# EAGLE design KwadraLampaBT (EAGLE 6.1)
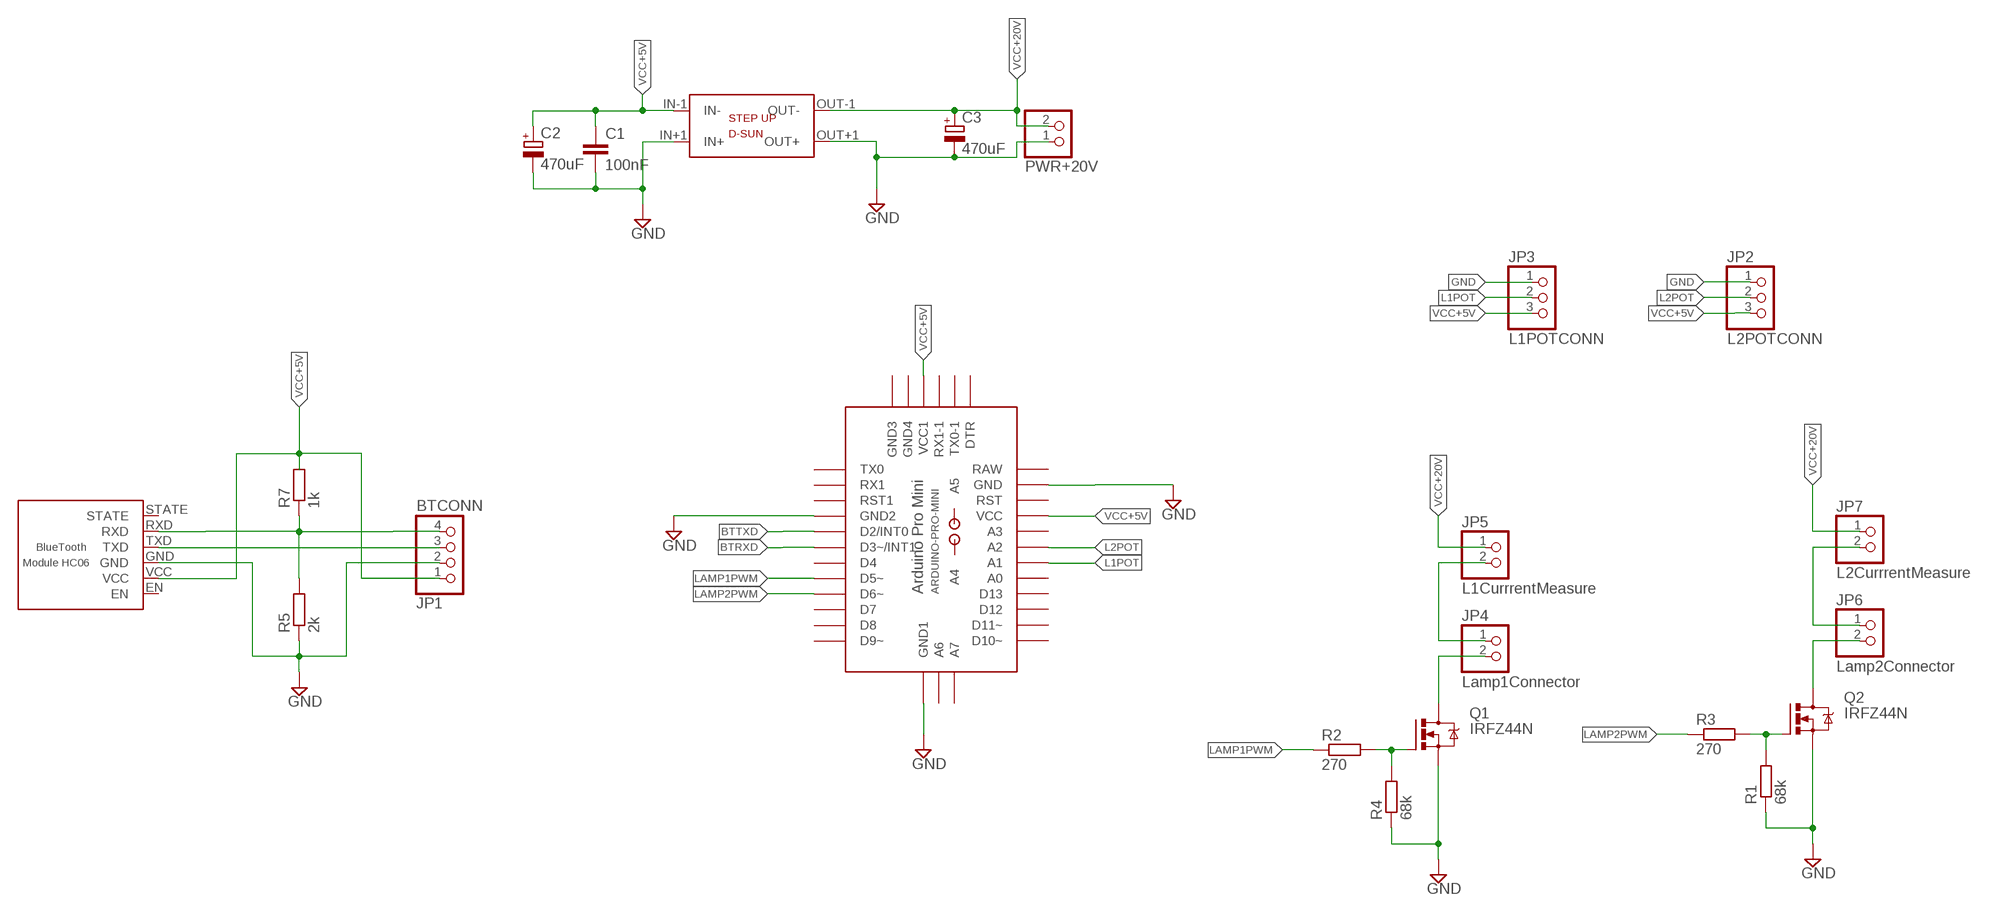
[diagram p0: schematic, sheet 1]

## Parts
C1  100nF  C_CERAMIC_2.5X50  [C025-025X050]
C2  470uF  C_ELECTROLYTIC_3  [C_E_R5-FI13_ELECTROLYTIC]
C3  470uF  C_ELECTROLYTIC_3  [C_E_R5-FI13_ELECTROLYTIC]
IC1  HC06  [HC06]
JP1  BTCONN  PINHD-1X4  [1X04]
JP2  L2POTCONN  PINHD-1X3  [1X03]
JP3  L1POTCONN  PINHD-1X3  [1X03]
JP4  Lamp1Connector  PINHD-1X2  [1X02]
JP5  L1CurrrentMeasure  PINHD-1X2  [1X02]
JP6  Lamp2Connector  PINHD-1X2  [1X02]
JP7  L2CurrrentMeasure  PINHD-1X2  [1X02]
PWR+20V  PINHD-1X2  [1X02]
Q1  IRFZ44N  IRFZ44NVERT  [TO220AB-GDS-VERT]
Q2  IRFZ44N  IRFZ44NVERT  [TO220AB-GDS-VERT]
R1  68k  R_SMD1206  [SMD1206]
R2  270  R_SMD1206  [SMD1206]
R3  270  R_SMD1206  [SMD1206]
R4  68k  R_SMD1206  [SMD1206]
R5  2k  R_SMD1206  [SMD1206]
R7  1k  R_SMD1206  [SMD1206]
U$1  ARDUINO-PRO-MINI  [ARDUINO-PRO-MINI]
U$2  STEPUP_D-SUN  [STEPUP_D-SUN]

## Nets
BTRXD: IC1.RXD JP1.4 R5.2 R7.1 U$1.D3(D3~/INT1)
BTTXD: IC1.TXD JP1.3 U$1.D2(D2/INT0)
GND: C1.2 C2.- C3.- IC1.GND JP1.2 JP2.1 JP3.1 PWR+20V.1 Q1.S Q2.S R1.1 R4.1 R5.1 U$1.GND U$1.GND1(GND2) U$1.GND4(GND1) U$2.IN+1(IN+) U$2.OUT+1(OUT+)
L1POT: JP3.2 U$1.A1
L2POT: JP2.2 U$1.A2
LAMP1PWM: R2.1 U$1.D5(D5~)
LAMP2PWM: R3.1 U$1.D6(D6~)
N$1: JP4.2 Q1.D
N$2: JP6.2 Q2.D
N$3: Q2.G R1.2 R3.2
N$4: Q1.G R2.2 R4.2
N$6: JP4.1 JP5.2
N$7: JP6.1 JP7.2
VCC+5V: C1.1 C2.+ IC1.VCC JP1.1 JP2.3 JP3.3 R7.2 U$1.VCC U$1.VCC1 U$2.IN-1(IN-)
VCC+20V: C3.+ JP5.1 JP7.1 PWR+20V.2 U$2.OUT-1(OUT-)
Unconnected: IC1.EN IC1.STATE U$1.A0 U$1.A3 U$1.A4 U$1.A5 U$1.A6 U$1.A7 U$1.D4 U$1.D7 U$1.D8 U$1.D9(D9~) U$1.D10(D10~) U$1.D11(D11~) U$1.D12 U$1.D13 U$1.DTR U$1.GND2(GND3) U$1.GND3(GND4) U$1.RAW U$1.RST U$1.RST1 U$1.RX1 U$1.RX1-1 U$1.TX0 U$1.TX0-1

## Library data of the parts
C1 = 00 My RLC:C_CERAMIC_
C2 C3 = 00 My RLC:C_ELECTROLYTIC_
IC1 = 00 MyModules:HC06
JP1 = 00 My Pinheaders:PINHD-1X4: PIN HEADER
JP2 JP3 = 00 My Pinheaders:PINHD-1X3: PIN HEADER
JP4-JP7 PWR+20V = 00 My Pinheaders:PINHD-1X2: PIN HEADER
Q1 Q2 = 00 My Transistors:IRFZ44N: IRFZ44N HEXFET® Power MOSFET VDSS = 55V RDS(on) = 17.5mW ID = 49A VGS(th) Gate Threshold Voltage 2.0 ––– 4.0 V VDS = VGS, ID = 250μA
R1-R5 R7 = 00 My RLC:R_
U$1 = 00 Arduino-clone:ARDUINO-PRO-MINI: Arduino Pro-Mini Arduino Clone by KubaMiszcz 2016
U$2 = 00 MyModules:STEPUP_D-SUN

## Board
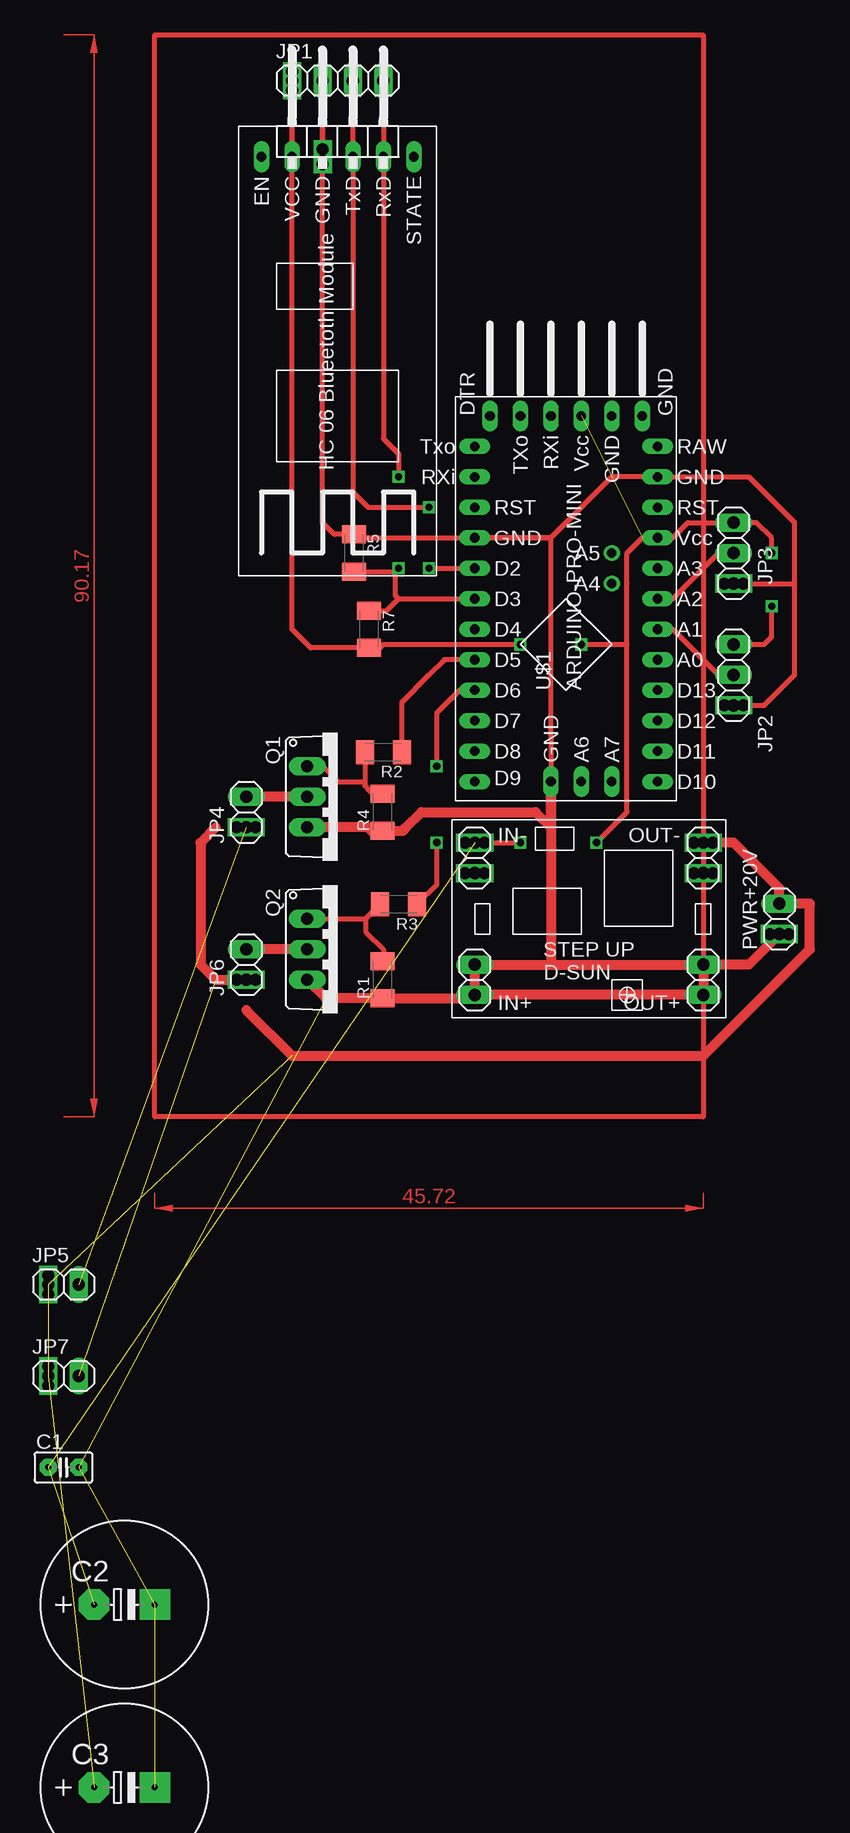
[diagram p1: board, top side]
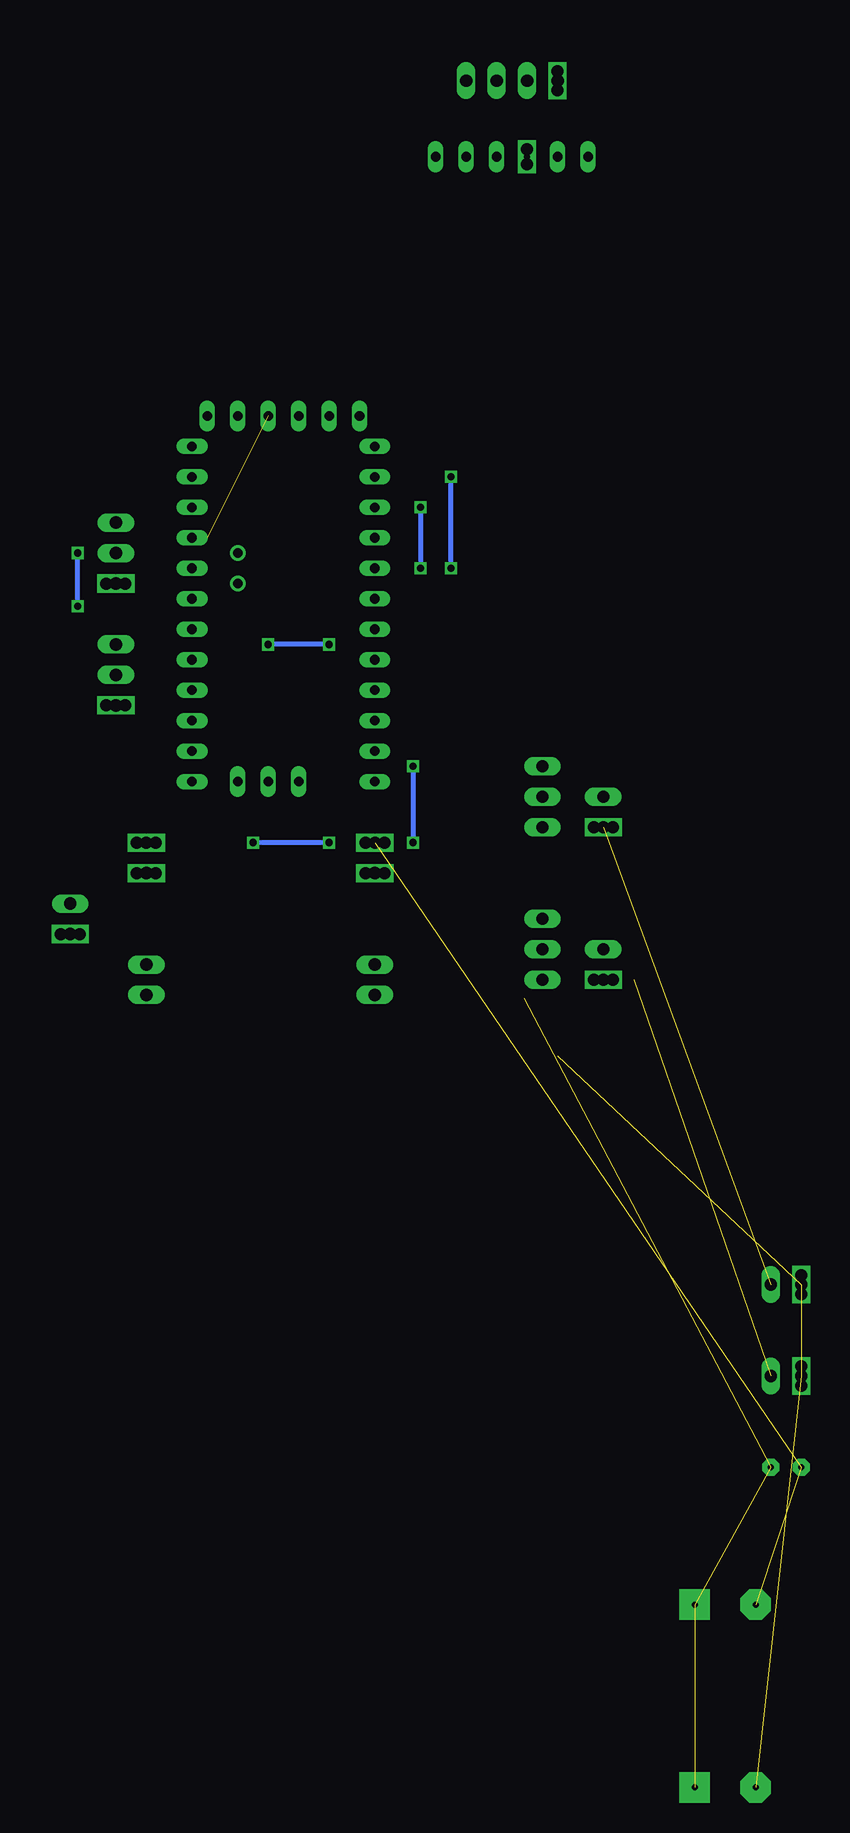
[diagram p2: board, bottom side, seen from below]

No outline drawn. Coordinates in mm, seen from the top.
Copper layers (1*16): Top 0.035mm / dielectric 1.5mm / Bottom 0.035mm
Design rules: minimum track width 10mil, minimum drill 24mil, track to track 8mil, track to pad 8mil, pad to pad 8mil, via to via 8mil, smd to smd 8mil, copper to edge 40mil, drill to drill 8mil, minimum pad ring 10mil, minimum via ring 8mil, stop-mask expansion 4mil, vias tented up to drill 0mil, thermal gap 10mil

### Footprints (pad centres in the part's own frame; a part is rotated, then mirrored left to right if it is on the bottom)
C025-025X050 = drill 0.5 pad 1.422 octagon: 1 -1.27,0; 2 1.27,0
C_E_R5-FI13_ELECTROLYTIC = drill 0.5 pad 2.54 octagon: + -2.54,0 | drill 0.5 pad 2.54 square: - 2.54,0
HC06 = drill 0.8 long: EN -12.7,-5.08; RXD -12.7,5.08; STATE -12.7,7.62; TXD -12.7,2.54; VCC -12.7,-2.54 | drill 0.5 pad 1.27 long: GND -12.7,0 | drill 1 square: P$4 -13.335,0.032; P$5 -13.335,0.032; P$6 -12.065,0.032
1X04 = drill 1.016 long: 1 -3.81,0; 2 -1.27,0; 3 1.27,0; 4 3.81,0 | drill 1 square: P$1 -3.81,0.794; P$2 -3.81,-0.794 | drill 1 long: P$3 -3.81,0
1X03 = drill 1.016 long: 1 -2.54,0; 2 0,0; 3 2.54,0 | drill 1 square: P$1 -2.54,0.794; P$2 -2.54,-0.794 | drill 1 long: P$3 -2.54,0
1X02 = drill 1.016 long: 1 -1.27,0; 2 1.27,0 | drill 1 square: P$1 -1.27,0.794; P$2 -1.27,-0.794 | drill 1 long: P$3 -1.27,0
TO220AB-GDS-VERT = drill 1.016 long: D 0,0; G -2.54,0; S 2.54,0
SMD1206 = smd 1.5 x 2: 1 -1.554,0.077; 2 1.546,0.077
ARDUINO-PRO-MINI = drill 0.8 long: A0 7.62,6.35; A1 7.62,3.81; A2 7.62,1.27; A3 7.62,-1.27; A6 1.27,-11.43; A7 3.81,-11.43; D2 -7.62,6.35; D3 -7.62,3.81; D4 -7.62,1.27; D5 -7.62,-1.27; D6 -7.62,-3.81; D7 -7.62,-6.35; D8 -7.62,-8.89; D9 -7.62,-11.43; D10 7.62,-11.43; D11 7.62,-8.89; D12 7.62,-6.35; D13 7.62,-3.81; DTR -6.35,19.05; GND 7.62,13.97; GND1 -7.62,8.89; GND2 6.35,19.05; GND3 3.81,19.05; GND4 -1.27,-11.43; RAW 7.62,16.51; RST 7.62,11.43; RST1 -7.62,11.43; RX1 -7.62,13.97; RX1-1 -1.27,19.05; TX0 -7.62,16.51; TX0-1 -3.81,19.05; VCC 7.62,8.89; VCC1 1.27,19.05 | drill 0.8: A4 3.81,5.08; A5 3.81,7.62
STEPUP_D-SUN = drill 1.016 long: 1 -10.16,3.81; 4 8.89,3.81; IN+1 -10.16,-3.81; IN+2 -10.16,-6.35; OUT+1 8.89,-3.81; OUT+2 8.89,-6.35 | drill 1 long: IN-1 -10.16,6.35; IN-2 -10.16,3.81; OUT-1 8.89,6.35; OUT-2 8.89,3.81 | drill 1 square: P$1 -10.954,3.81; P$2 -9.366,3.81; P$4 8.096,3.81; P$5 9.684,3.81; P$7 -10.954,6.35; P$8 -9.366,6.35; P$10 8.096,6.35; P$11 9.684,6.35

### Placement (x,y rotation side)
C1  3.81,-148.59 0 top
C2  8.89,-160.02 0 top
C3  8.89,-175.26 0 top
IC1  25.4,-52.07 270 top
JP1  26.67,-33.02 0 top
JP2  59.69,-82.55 90 top
JP3  59.69,-72.39 90 top
JP4  19.05,-93.98 90 top
JP5  3.81,-133.35 0 top
JP6  19.05,-106.68 90 top
JP7  3.81,-140.97 0 top
PWR+20V  63.5,-102.87 90 top
Q1  24.13,-92.71 270 top
Q2  24.13,-105.41 270 top
R1  30.48,-107.95 90 top
R2  30.48,-88.9 180 top
R3  31.75,-101.6 180 top
R4  30.48,-93.98 90 top
R5  27.94,-72.39 270 top
R7  29.21,-78.74 270 top
U$1  45.72,-80.01 0 top
U$2  48.26,-102.87 0 top

### Tracks (layer width: path | path; a pad name or v marks a point on that pad's centre or on a via)
BTRXD  (via drill 0.6)
  Top 0.406: JP1.4 IC1.RXD 30.48,-62.87 31.75,-64.14 v31.75,-66.04 | R7.1 29.49,-77.19 30.76,-77.19 31.75,-76.2 | 31.75,-76.2 U$1.D3 | R5.2 31.47,-73.94 | 31.47,-73.94 v31.75,-73.66 | 31.47,-73.94 31.47,-75.92 31.75,-76.2
  Bottom 0.406: v31.75,-73.66 v31.75,-66.04
BTTXD  (via drill 0.6)
  Top 0.406: JP1.3 IC1.TXD 27.94,-67.31 29.21,-68.58 v34.29,-68.58 | v34.29,-73.66 34.92,-73.66 U$1.D2
  Bottom 0.406: v34.29,-68.58 v34.29,-73.66
GND  (3 unrouted)
  Top 0.406: 44.45,-71.12 49.53,-66.04 U$1.GND 60.96,-66.04 64.77,-69.85 64.77,-74.93 | 44.45,-71.12 U$1.GND1 | U$1.GND1 44.45,-71.12 | IC1.GND JP1.2 IC1.GND | U$1.GND1 44.45,-71.12 | U$1.GND4 44.45,-87.63 44.45,-74.93 44.45,-71.12 | 64.77,-74.93 64.77,-82.55 62.23,-85.09 JP2.1 | JP3.1 64.77,-74.93 | IC1.GND 25.4,-69.85 26.39,-70.84 27.66,-70.84 R5.1 28.29,-70.84 28.57,-71.12 U$1.GND1
  Top 0.813: PWR+20V.1 60.96,-106.68 U$2.OUT+1 | U$2.OUT+1 57.15,-109.22 38.1,-109.22 | 38.1,-109.22 U$2.IN+1 44.45,-106.68 | 44.45,-106.68 U$2.OUT+1 | 44.45,-95.25 U$1.GND4 44.45,-95.25 | 44.45,-95.25 44.45,-106.68 | 38.1,-109.22 37.82,-109.5 R1.1 25.68,-109.5 Q2.S | 44.45,-95.25 43.18,-93.98 33.66,-93.98 32.38,-95.25 32.1,-95.53 R4.1 29.49,-95.53 29.21,-95.25 Q1.S
L1POT
  Top 0.406: U$1.A1 54.61,-76.2 58.42,-72.39 JP3.2
L2POT
  Top 0.406: U$1.A2 54.61,-78.74 58.42,-82.55 JP2.2
LAMP1PWM
  Top 0.406: U$1.D5 35.56,-81.28 34.29,-82.55 32.03,-84.81 R2.1
LAMP2PWM  (via drill 0.6)
  Top 0.406: U$1.D6 36.83,-83.82 35.56,-85.09 34.92,-85.72 v34.92,-90.17 | R3.1 34.92,-100.06 v34.92,-96.52
  Bottom 0.406: v34.92,-90.17 v34.92,-96.52
N$1
  Top 0.813: Q1.D JP4.2
N$2
  Top 0.813: Q2.D JP6.2
N$3
  Top 0.406: Q2.G 29.01,-102.87 | 29.01,-102.87 R3.2 | 29.01,-102.87 29.01,-103.94 30.48,-105.41 30.48,-106.33 R1.2
N$4
  Top 0.406: R2.2 28.93,-91.44 | 28.93,-91.44 28.93,-91.8 29.21,-92.08 29.57,-92.43 R4.2 | Q1.G 25.4,-90.17 26.67,-91.44 28.93,-91.44
N$5
  Top 0.406: 11.43,-119.38 11.43,-29.21 57.15,-29.21 57.15,-119.38 11.43,-119.38
N$6  (1 unrouted)
N$7  (1 unrouted)
  Top 0.813: 16.51,-95.25 15.24,-96.52 15.24,-106.68 16.51,-107.95 JP6.1
VCC+5V  (via drill 0.6)  (3 unrouted)
  Top 0.406: IC1.VCC JP1.1 IC1.VCC | v62.87,-76.83 62.87,-79.38 62.23,-80.01 JP2.3 | v62.87,-72.39 62.87,-71.12 61.59,-69.85 JP3.3 55.88,-69.85 54.61,-71.12 U$1.VCC 52.07,-71.12 50.8,-72.39 50.8,-74.93 50.8,-80.01 | U$2.IN-1 39.37,-96.52 40.01,-96.52 v41.91,-96.52 | v48.26,-96.52 50.8,-93.98 50.8,-80.01 | v46.99,-80.01 50.8,-80.01 | v41.91,-80.01 30.48,-80.01 30.2,-80.29 R7.2 24.41,-80.29 22.86,-78.74 IC1.VCC
  Bottom 0.406: v62.87,-76.83 v62.87,-72.39 | v41.91,-96.52 v48.26,-96.52 | v41.91,-80.01 v46.99,-80.01
VCC+20V  (3 unrouted)
  Top 0.813: U$2.OUT-1 59.69,-96.52 63.5,-100.33 PWR+20V.2 66.04,-101.6 66.04,-105.41 57.15,-114.3 22.86,-114.3 19.05,-110.49
(copper drawn outside any net)
  shapes: Top area x2